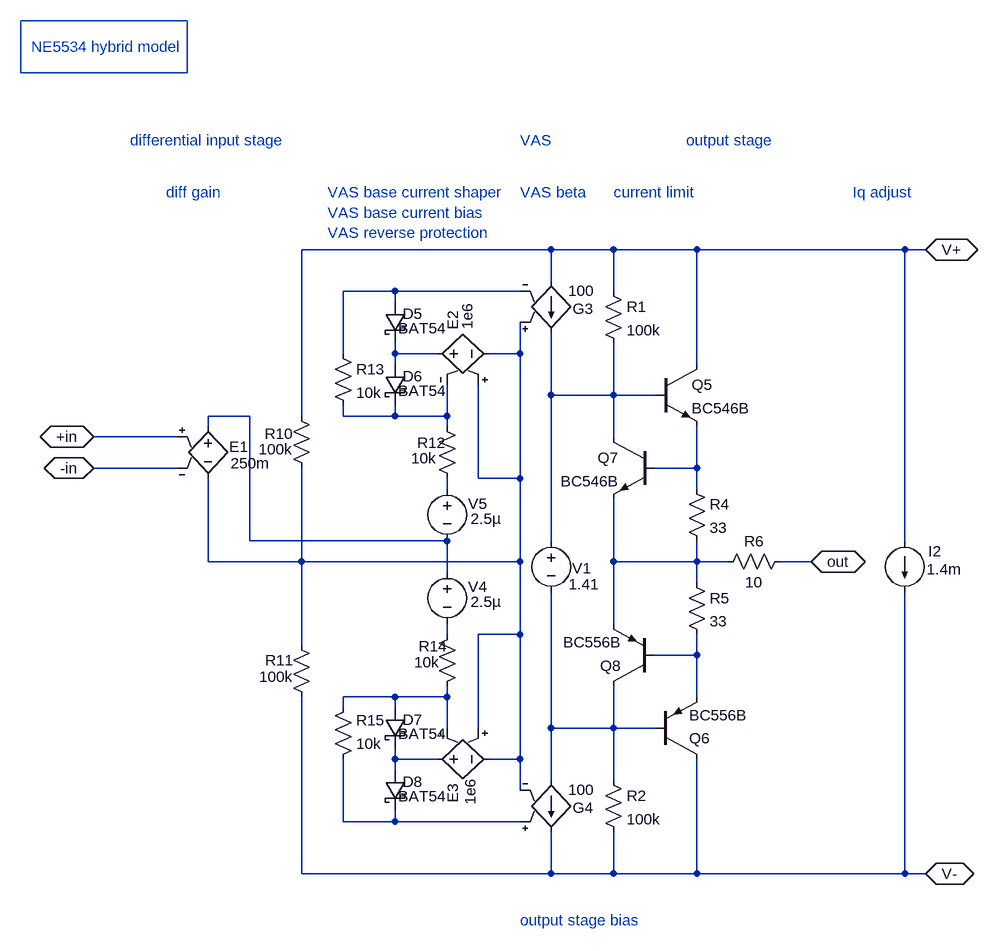
[diagram p0: schematic NE5534_h2.asc]
NE5534_h2.asc, the LTspice schematic file:
Version 4
SHEET 1 1224 756
WIRE 256 -480 -128 -480
WIRE 352 -480 256 -480
WIRE 480 -480 352 -480
WIRE 800 -480 480 -480
WIRE 832 -480 800 -480
WIRE 256 -432 256 -480
WIRE 16 -416 -64 -416
WIRE 208 -416 16 -416
WIRE 352 -416 352 -480
WIRE 16 -400 16 -416
WIRE -64 -320 -64 -416
WIRE 16 -320 16 -336
WIRE 80 -320 16 -320
WIRE 208 -320 208 -368
WIRE 208 -320 160 -320
WIRE 16 -304 16 -320
WIRE 480 -304 480 -480
WIRE 256 -256 256 -352
WIRE 352 -256 352 -336
WIRE 352 -256 256 -256
WIRE 416 -256 352 -256
WIRE -208 -224 -272 -224
WIRE -128 -224 -128 -480
WIRE -64 -224 -64 -240
WIRE 16 -224 16 -240
WIRE 16 -224 -64 -224
WIRE 96 -224 96 -272
WIRE 96 -224 16 -224
WIRE -272 -208 -272 -224
WIRE 96 -208 96 -224
WIRE -320 -192 -448 -192
WIRE 352 -192 352 -256
WIRE -320 -144 -448 -144
WIRE 480 -144 480 -208
WIRE 480 -144 416 -144
WIRE 144 -128 144 -272
WIRE 208 -128 208 -320
WIRE 208 -128 144 -128
WIRE 96 -112 96 -128
WIRE 480 -112 480 -144
WIRE -208 -32 -208 -224
WIRE 96 -32 -208 -32
WIRE 256 -32 256 -256
WIRE 800 -32 800 -480
WIRE -272 0 -272 -128
WIRE -128 0 -128 -144
WIRE -128 0 -272 0
WIRE 208 0 208 -128
WIRE 208 0 -128 0
WIRE 352 0 352 -96
WIRE 480 0 480 -32
WIRE 480 0 352 0
WIRE 528 0 480 0
WIRE 656 0 608 0
WIRE 96 16 96 -32
WIRE 480 32 480 0
WIRE 352 96 352 0
WIRE 96 112 96 96
WIRE 208 112 208 0
WIRE 208 112 144 112
WIRE -128 128 -128 0
WIRE 480 144 480 112
WIRE 480 144 416 144
WIRE 16 208 -64 208
WIRE 96 208 96 192
WIRE 96 208 16 208
WIRE 480 208 480 144
WIRE -64 224 -64 208
WIRE 16 224 16 208
WIRE 96 256 96 208
WIRE 144 256 144 112
WIRE 256 256 256 48
WIRE 352 256 352 192
WIRE 352 256 256 256
WIRE 416 256 352 256
WIRE 16 304 16 288
WIRE 80 304 16 304
WIRE 208 304 208 112
WIRE 208 304 160 304
WIRE 16 320 16 304
WIRE 256 336 256 256
WIRE 352 336 352 256
WIRE 208 352 208 304
WIRE -64 400 -64 304
WIRE 16 400 16 384
WIRE 16 400 -64 400
WIRE 208 400 16 400
WIRE -128 480 -128 208
WIRE 256 480 256 416
WIRE 256 480 -128 480
WIRE 352 480 352 416
WIRE 352 480 256 480
WIRE 480 480 480 304
WIRE 480 480 352 480
WIRE 800 480 800 48
WIRE 800 480 480 480
WIRE 832 480 800 480
FLAG -448 -192 +in
IOPIN -448 -192 BiDir
FLAG -448 -144 -in
IOPIN -448 -144 BiDir
FLAG 656 0 out
IOPIN 656 0 BiDir
FLAG 832 -480 V+
IOPIN 832 -480 BiDir
FLAG 832 480 V-
IOPIN 832 480 BiDir
SYMBOL npn 416 -304 R0
SYMATTR InstName Q5
SYMATTR Value BC546B
SYMBOL pnp 416 304 M180
WINDOW 0 52 32 Left 0
WINDOW 3 52 68 Left 0
SYMATTR InstName Q6
SYMATTR Value BC556B
SYMBOL npn 416 -192 M0
SYMATTR InstName Q7
SYMATTR Value BC546B
SYMBOL pnp 416 192 R180
WINDOW 0 52 32 Left 0
WINDOW 3 52 68 Left 0
SYMATTR InstName Q8
SYMATTR Value BC556B
SYMBOL res 464 -128 R0
SYMATTR InstName R4
SYMATTR Value 33
SYMBOL res 464 16 R0
SYMATTR InstName R5
SYMATTR Value 33
SYMBOL res 624 -16 R90
WINDOW 0 0 56 VBottom 0
WINDOW 3 32 56 VTop 0
SYMATTR InstName R6
SYMATTR Value 10
SYMBOL voltage 256 -48 R0
WINDOW 0 32 58 Left 0
WINDOW 3 27 83 Left 0
WINDOW 123 0 0 Left 0
WINDOW 39 0 0 Left 0
SYMATTR InstName V1
SYMATTR Value 1.41
SYMBOL e2 64 -320 R270
WINDOW 0 37 41 Left 0
WINDOW 3 37 63 Left 0
SYMATTR InstName E2
SYMATTR Value 1e6
SYMBOL res 80 -224 R0
WINDOW 0 -30 41 Left 0
WINDOW 3 -39 65 Left 0
SYMATTR InstName R12
SYMATTR Value 10k
SYMBOL res -80 -336 R0
SYMATTR InstName R13
SYMATTR Value 10k
SYMBOL res 80 208 M180
WINDOW 0 -28 78 Left 0
WINDOW 3 -35 53 Left 0
SYMATTR InstName R14
SYMATTR Value 10k
SYMBOL res -80 320 M180
WINDOW 0 36 76 Left 0
WINDOW 3 36 40 Left 0
SYMATTR InstName R15
SYMATTR Value 10k
SYMBOL res -144 -240 R0
WINDOW 0 -41 43 Left 0
WINDOW 3 -50 67 Left 0
SYMATTR InstName R10
SYMATTR Value 100k
SYMBOL res -144 112 R0
WINDOW 0 -40 40 Left 0
WINDOW 3 -49 65 Left 0
SYMATTR InstName R11
SYMATTR Value 100k
SYMBOL e -272 -224 R0
WINDOW 0 33 47 Left 0
WINDOW 3 35 73 Left 0
SYMATTR InstName E1
SYMATTR Value 250m
SYMBOL current 800 -32 R0
WINDOW 0 36 16 Left 0
WINDOW 3 34 44 Left 0
WINDOW 123 0 0 Left 0
WINDOW 39 0 0 Left 0
SYMATTR InstName I2
SYMATTR Value 1.4m
SYMBOL voltage 96 0 R0
WINDOW 0 32 39 Left 0
WINDOW 3 36 62 Left 0
WINDOW 123 0 0 Left 0
WINDOW 39 0 0 Left 0
SYMATTR InstName V4
SYMATTR Value 2.5µ
SYMBOL voltage 96 -128 R0
WINDOW 0 32 39 Left 0
WINDOW 3 36 62 Left 0
WINDOW 123 0 0 Left 0
WINDOW 39 0 0 Left 0
SYMATTR InstName V5
SYMATTR Value 2.5µ
SYMBOL schottky 32 -400 M0
WINDOW 0 -26 19 Left 0
WINDOW 3 -62 41 Left 0
SYMATTR InstName D5
SYMATTR Value BAT54
SYMATTR Description Diode
SYMATTR Type diode
SYMBOL schottky 32 -304 M0
WINDOW 0 -26 19 Left 0
WINDOW 3 -62 41 Left 0
SYMATTR InstName D6
SYMATTR Value BAT54
SYMATTR Description Diode
SYMATTR Type diode
SYMBOL schottky 32 224 M0
WINDOW 0 -26 19 Left 0
WINDOW 3 -62 41 Left 0
SYMATTR InstName D7
SYMATTR Value BAT54
SYMATTR Description Diode
SYMATTR Type diode
SYMBOL schottky 32 320 M0
WINDOW 0 -26 19 Left 0
WINDOW 3 -62 41 Left 0
SYMATTR InstName D8
SYMATTR Value BAT54
SYMATTR Description Diode
SYMATTR Type diode
SYMBOL g 256 -336 M180
WINDOW 0 33 53 Left 0
WINDOW 3 26 81 Left 0
SYMATTR InstName G3
SYMATTR Value 100
SYMBOL g 256 432 M180
WINDOW 0 33 53 Left 0
WINDOW 3 26 81 Left 0
SYMATTR InstName G4
SYMATTR Value 100
SYMBOL e2 64 304 M90
WINDOW 0 38 41 Left 0
WINDOW 3 30 68 Left 0
SYMATTR InstName E3
SYMATTR Value 1e6
SYMBOL res 336 -432 R0
SYMATTR InstName R1
SYMATTR Value 100k
SYMBOL res 336 320 R0
SYMATTR InstName R2
SYMATTR Value 100k
TEXT -392 -648 Left 0 ;differential input stage
TEXT -336 -568 Left 0 ;diff gain
TEXT -88 -568 Left 0 ;VAS base current shaper\nVAS base current bias\nVAS reverse protection
TEXT 464 -648 Left 0 ;output stage
TEXT 352 -568 Left 0 ;current limit
TEXT 720 -568 Left 0 ;Iq adjust
TEXT -544 -792 Left 0 ;NE5534 hybrid model
TEXT 208 552 Left 0 ;output stage bias
TEXT 208 -568 Left 0 ;VAS beta
TEXT 208 -648 Left 0 ;VAS
RECTANGLE Normal -304 -752 -560 -832

The netlist it stands for:
* NE5534_h2.asc
Q5 V+ N004 N007 0 BC546B
Q6 V- N013 N011 0 BC556B
Q7 N004 N007 N009 0 BC546B
Q8 N013 N011 N009 0 BC556B
R4 N007 N009 33
R5 N009 N011 33
R6 out N009 10
V1 N004 N013 1.41
E2 N002 N003 N003 N006 1e6
R12 N006 N008 10k
R13 N001 N006 10k
R14 N012 N010 10k
R15 N015 N012 10k
R10 V+ N003 100k
R11 N003 V- 100k
E1 N005 N003 +in -in 250m
I2 V+ V- 1.4m
V4 N005 N010 2.5µ
V5 N008 N005 2.5µ
D5 N001 N002 BAT54
D6 N002 N006 BAT54
D7 N012 N014 BAT54
D8 N014 N015 BAT54
G3 V+ N004 N003 N001 100
G4 N013 V- N015 N003 100
E3 N014 N003 N003 N012 1e6
R1 V+ N004 100k
R2 N013 V- 100k
.model D D
.lib standard.dio
.model NPN NPN
.model PNP PNP
.lib standard.bjt
* differential input stage
* diff gain
* VAS base current shaper
* VAS base current bias
* VAS reverse protection
* output stage
* current limit
* Iq adjust
* NE5534 hybrid model
* output stage bias
* VAS beta
* VAS
.backanno
.end